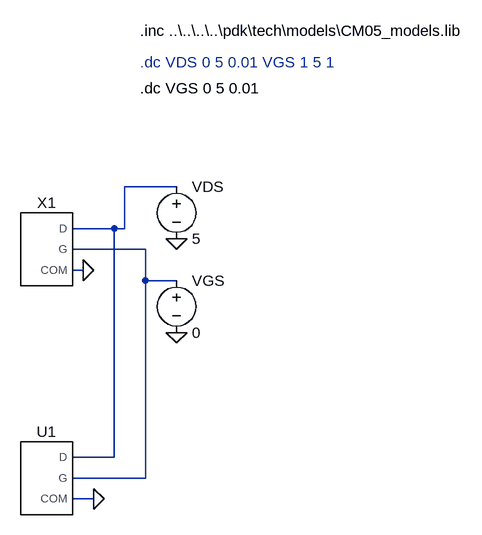
[diagram p0: schematic Unidad_N_tb.asc]
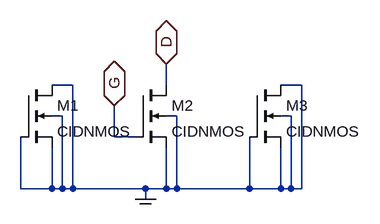
[diagram p1: sub-circuit unidad_n.asc]
Unidad_N_tb.asc, the LTspice schematic file:
Version 4.1
SHEET 1 904 680
WIRE 384 64 304 64
WIRE 288 128 224 128
WIRE 304 128 304 64
WIRE 304 128 288 128
WIRE 336 160 224 160
WIRE 240 192 224 192
WIRE 336 208 336 160
WIRE 384 208 336 208
WIRE 288 480 288 128
WIRE 288 480 224 480
WIRE 336 512 336 208
WIRE 336 512 224 512
WIRE 256 544 224 544
FLAG 240 192 0
FLAG 384 144 0
FLAG 384 288 0
FLAG 256 544 0
SYMBOL Unidad_N 176 160 R0
SYMATTR InstName X1
SYMBOL voltage 384 48 R0
WINDOW 123 0 0 Left 0
WINDOW 39 0 0 Left 0
SYMATTR InstName VDS
SYMATTR Value 5
SYMBOL voltage 384 192 R0
WINDOW 123 0 0 Left 0
WINDOW 39 0 0 Left 0
SYMATTR InstName VGS
SYMATTR Value 0
SYMBOL Unidad_N_lay 176 512 R0
SYMATTR InstName U1
TEXT 328 -176 Left 2 !.inc ..\\..\\..\\..\\pdk\\tech\\models\\CM05_models.lib
TEXT 328 -128 Left 2 ;.dc VDS 0 5 0.01 VGS 1 5 1
TEXT 328 -88 Left 2 !.dc VGS 0 5 0.01

unidad_n.asc, the sub-circuit schematic file:
Version 4.1
SHEET 1 880 680
WIRE 96 96 64 96
WIRE 240 96 240 64
WIRE 448 96 416 96
WIRE 80 144 64 144
WIRE 256 144 240 144
WIRE 432 144 416 144
WIRE 160 176 160 128
WIRE 192 176 160 176
WIRE 16 256 16 176
WIRE 64 256 64 192
WIRE 64 256 16 256
WIRE 80 256 80 144
WIRE 80 256 64 256
WIRE 96 256 96 96
WIRE 96 256 80 256
WIRE 208 256 96 256
WIRE 240 256 240 192
WIRE 240 256 208 256
WIRE 256 256 256 144
WIRE 256 256 240 256
WIRE 368 256 368 176
WIRE 368 256 256 256
WIRE 416 256 416 192
WIRE 416 256 368 256
WIRE 432 256 432 144
WIRE 432 256 416 256
WIRE 448 256 448 96
WIRE 448 256 432 256
WIRE 208 272 208 256
FLAG 208 272 COM
IOPIN 208 272 BiDir
FLAG 160 128 G
IOPIN 160 128 BiDir
FLAG 240 64 D
IOPIN 240 64 BiDir
SYMBOL nmos4 16 96 R0
SYMATTR InstName M1
SYMATTR Value CIDNMOS
SYMATTR Value2 l=10u w=100u
SYMBOL nmos4 192 96 R0
SYMATTR InstName M2
SYMATTR Value CIDNMOS
SYMATTR Value2 l=10u w=100u
SYMBOL nmos4 368 96 R0
SYMATTR InstName M3
SYMATTR Value CIDNMOS
SYMATTR Value2 l=10u w=100u

The netlist it stands for:
* Unidad_N_tb.asc
X§X1 N001 N002 0 unidad_n
VDS N001 0 5
VGS N002 0 0
X§U1 N001 N002 0 Unidad_N  ; pins D G COM

* block symbol definitions
.subckt unidad_n D G COM
M1 COM COM COM COM CIDNMOS l=10u w=100u
M2 D G COM COM CIDNMOS l=10u w=100u
M3 COM COM COM COM CIDNMOS l=10u w=100u
.ends unidad_n

.model NMOS NMOS
.model PMOS PMOS
.lib standard.mos
.inc ..\..\..\..\pdk\tech\models\CM05_models.lib
* .dc VDS 0 5 0.01 VGS 1 5 1
.dc VGS 0 5 0.01
.backanno
.end